# Altium schematic sheet Front_Board.SchDoc
size B; SheetNumber: 2; SheetTotal: 4
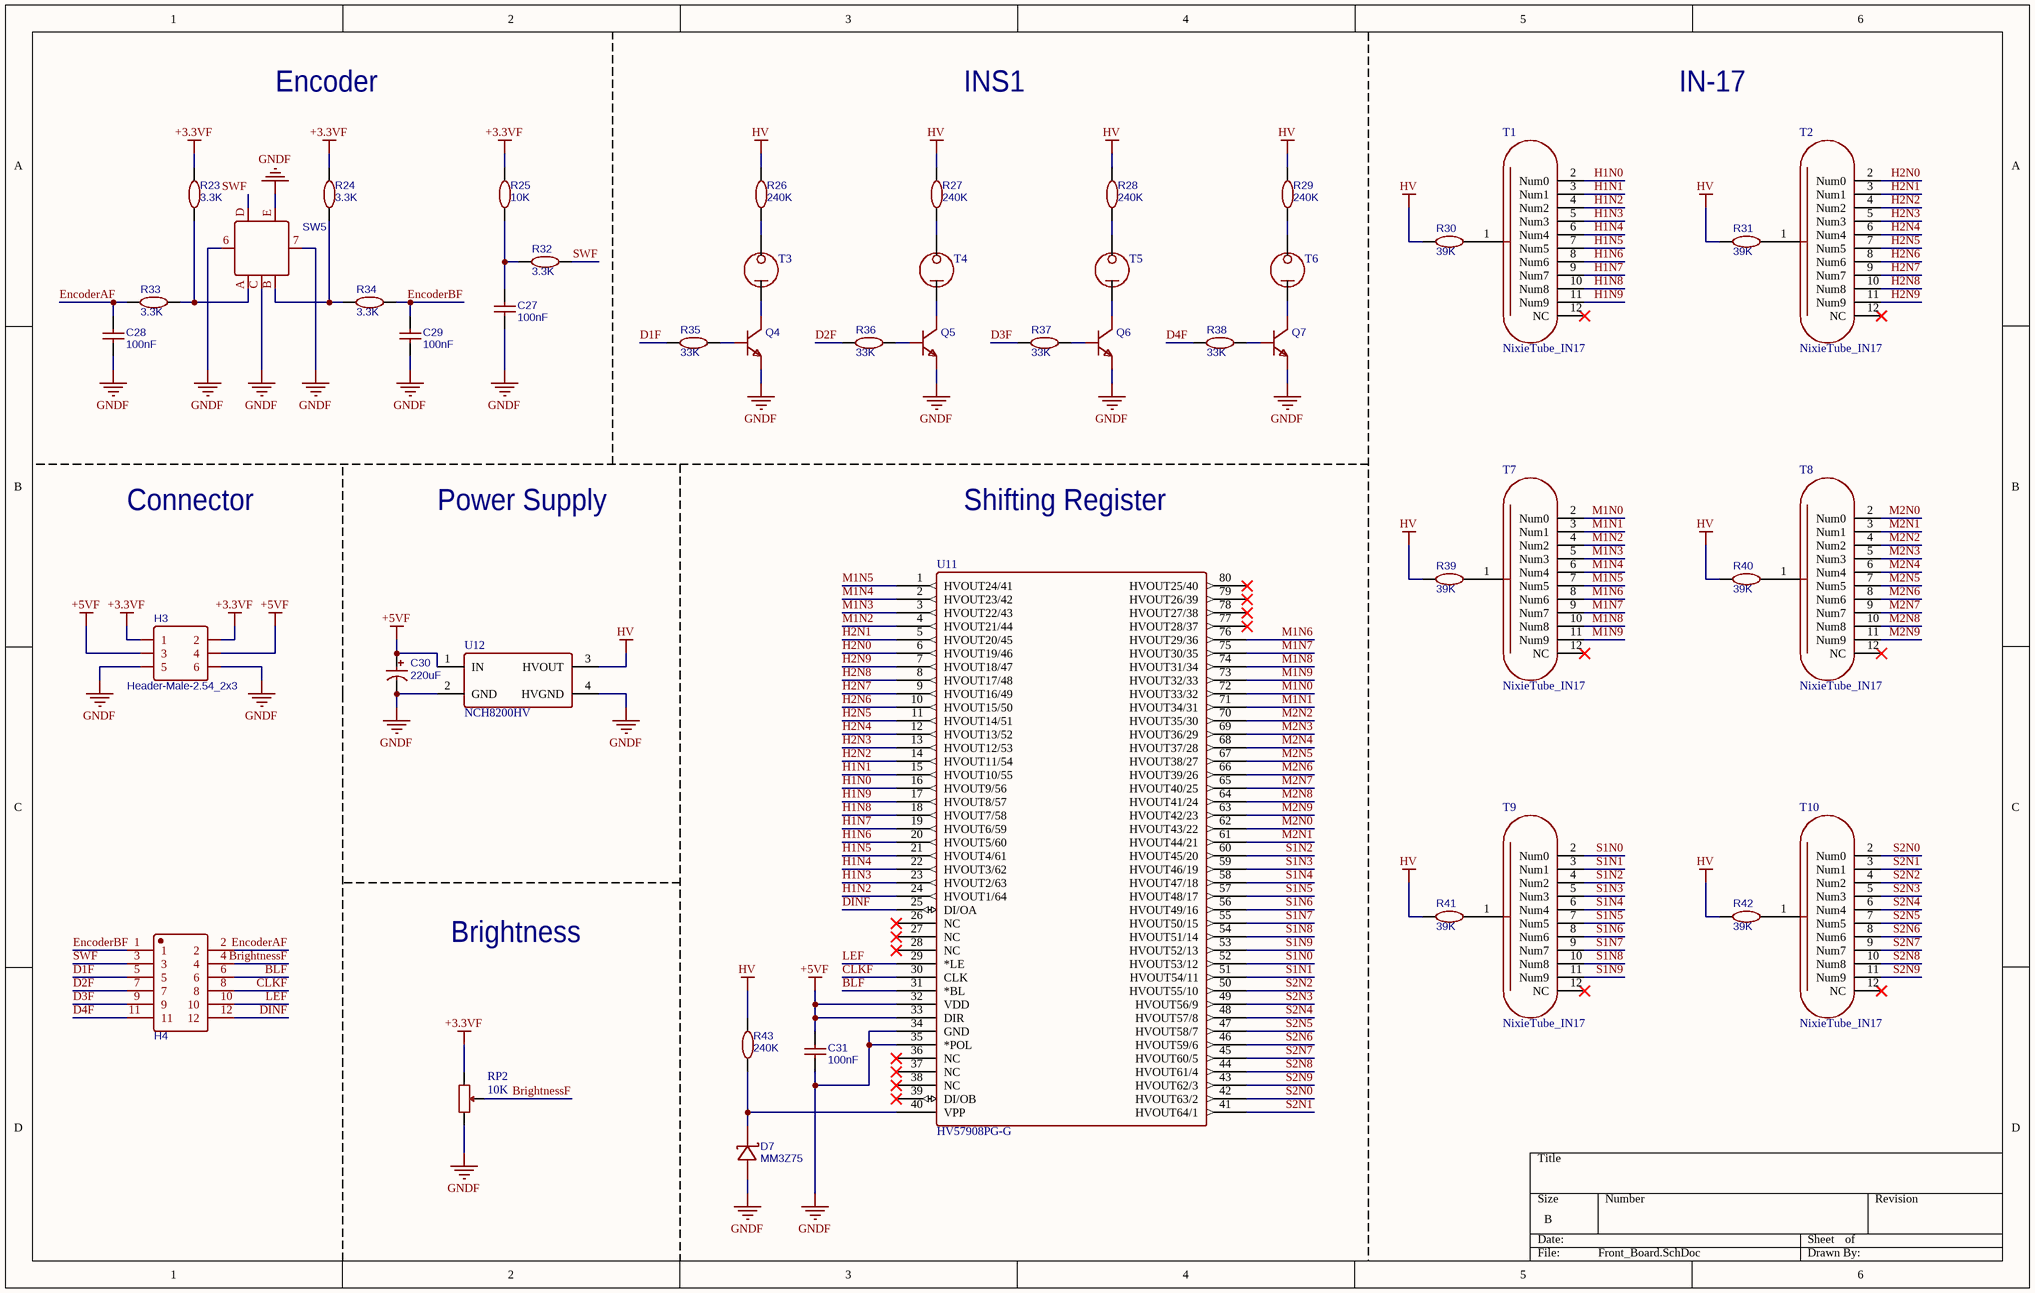
[diagram p0: Front_Board.SchDoc]

## Parts
C27  100nF  [C0402_NEW]
C28  100nF  [C0402_NEW]
C29  100nF  [C0402_NEW]
C30  220uF  [CAP-TH_BD6.3-P2.50-D1.0-FD]
C31  100nF  [C0402_NEW]
D7  MM3Z75  [SOD-323_L1.8-W1.3-LS2.5-RD]
H3  Header-Male-2.54_2x3  [HDR-TH_6P-P2.54-V-M-R2-C3-S2.54-1]
H4  210S-2*6P L=11.6MMGold-plated black  [HDR-TH_12P-P2.54-V-M-R2-C6-S2.54]  (value not drawn)
Q4  MMBTA44_C699224  [SOT-23-3_L2.9-W1.3-P1.90-LS2.4-BR]  (value not drawn)
Q5  MMBTA44_C699224  [SOT-23-3_L2.9-W1.3-P1.90-LS2.4-BR]  (value not drawn)
Q6  MMBTA44_C699224  [SOT-23-3_L2.9-W1.3-P1.90-LS2.4-BR]  (value not drawn)
Q7  MMBTA44_C699224  [SOT-23-3_L2.9-W1.3-P1.90-LS2.4-BR]  (value not drawn)
R23  3.3K  [R0402]
R24  3.3K  [R0402]
R25  10K  [R0402]
R26  240K  [R0805]
R27  240K  [R0805]
R28  240K  [R0805]
R29  240K  [R0805]
R30  39K  [R0805]
R31  39K  [R0805]
R32  3.3K  [R0402]
R33  3.3K  [R0402]
R34  3.3K  [R0402]
R35  33K  [R0402]
R36  33K  [R0402]
R37  33K  [R0402]
R38  33K  [R0402]
R39  39K  [R0805]
R40  39K  [R0805]
R41  39K  [R0805]
R42  39K  [R0805]
R43  240K  [R0805]
RP2  10K  [WH148-W-B10K]
SW5  EC11E09244C3  [SW-TH_EC11E09244C3]  (value not drawn)
T1  NixieTube_IN17  [IN17]
T2  NixieTube_IN17  [IN17]
T3  NixieTube_INS1  [INS-1]  (value not drawn)
T4  NixieTube_INS1  [INS-1]  (value not drawn)
T5  NixieTube_INS1  [INS-1]  (value not drawn)
T6  NixieTube_INS1  [INS-1]  (value not drawn)
T7  NixieTube_IN17  [IN17]
T8  NixieTube_IN17  [IN17]
T9  NixieTube_IN17  [IN17]
T10  NixieTube_IN17  [IN17]
U11  HV57908PG-G  [PQFP80_20X14MC_MCH]
U12  NCH8200HV  [NCH8200HV]

## Nets
+3.3VF: H3.1 H3.2 R23.2 R24.2 R25.2 RP2.1
+5VF: C30.1 C31.2 H3.3 H3.4 U11.32(VDD) U11.33(DIR) U12.1(IN)
GNDF: C27.1 C28.1 C29.1 C30.2 C31.1 D7.2(A) H3.5 H3.6 Q4.2(E) Q5.2(E) Q6.2(E) Q7.2(E) RP2.3 SW5.6(EH) SW5.7(EH) SW5.C SW5.E U11.34(GND) U11.35(*POL) U12.2(GND) U12.4(HVGND)
HV: R26.2 R27.2 R28.2 R29.2 R30.1 R31.1 R39.1 R40.1 R41.1 R42.1 R43.2 U12.3(HVOUT)
BLF: H4.6 U11.31(*BL)
BrightnessF: H4.4 RP2.2
CLKF: H4.8 U11.30(CLK)
D1F: H4.5 R35.1
D2F: H4.7 R36.1
D3F: H4.9 R37.1
D4F: H4.11 R38.1
DINF: H4.12 U11.25(DI/OA)
EncoderAF: C28.2 H4.2 R33.2
EncoderBF: C29.2 H4.1 R34.1
H1N0: T1.2(Num0) U11.16(HVOUT9/56)
H1N1: T1.3(Num1) U11.15(HVOUT10/55)
H1N2: T1.4(Num2) U11.24(HVOUT1/64)
H1N3: T1.5(Num3) U11.23(HVOUT2/63)
H1N4: T1.6(Num4) U11.22(HVOUT3/62)
H1N5: T1.7(Num5) U11.21(HVOUT4/61)
H1N6: T1.8(Num6) U11.20(HVOUT5/60)
H1N7: T1.9(Num7) U11.19(HVOUT6/59)
H1N8: T1.10(Num8) U11.18(HVOUT7/58)
H1N9: T1.11(Num9) U11.17(HVOUT8/57)
H2N0: T2.2(Num0) U11.6(HVOUT19/46)
H2N1: T2.3(Num1) U11.5(HVOUT20/45)
H2N2: T2.4(Num2) U11.14(HVOUT11/54)
H2N3: T2.5(Num3) U11.13(HVOUT12/53)
H2N4: T2.6(Num4) U11.12(HVOUT13/52)
H2N5: T2.7(Num5) U11.11(HVOUT14/51)
H2N6: T2.8(Num6) U11.10(HVOUT15/50)
H2N7: T2.9(Num7) U11.9(HVOUT16/49)
H2N8: T2.10(Num8) U11.8(HVOUT17/48)
H2N9: T2.11(Num9) U11.7(HVOUT18/47)
LEF: H4.10 U11.29(*LE)
M1N0: T7.2(Num0) U11.72(HVOUT33/32)
M1N1: T7.3(Num1) U11.71(HVOUT34/31)
M1N2: T7.4(Num2) U11.4(HVOUT21/44)
M1N3: T7.5(Num3) U11.3(HVOUT22/43)
M1N4: T7.6(Num4) U11.2(HVOUT23/42)
M1N5: T7.7(Num5) U11.1(HVOUT24/41)
M1N6: T7.8(Num6) U11.76(HVOUT29/36)
M1N7: T7.9(Num7) U11.75(HVOUT30/35)
M1N8: T7.10(Num8) U11.74(HVOUT31/34)
M1N9: T7.11(Num9) U11.73(HVOUT32/33)
M2N0: T8.2(Num0) U11.62(HVOUT43/22)
M2N1: T8.3(Num1) U11.61(HVOUT44/21)
M2N2: T8.4(Num2) U11.70(HVOUT35/30)
M2N3: T8.5(Num3) U11.69(HVOUT36/29)
M2N4: T8.6(Num4) U11.68(HVOUT37/28)
M2N5: T8.7(Num5) U11.67(HVOUT38/27)
M2N6: T8.8(Num6) U11.66(HVOUT39/26)
M2N7: T8.9(Num7) U11.65(HVOUT40/25)
M2N8: T8.10(Num8) U11.64(HVOUT41/24)
M2N9: T8.11(Num9) U11.63(HVOUT42/23)
S1N0: T9.2(Num0) U11.52(HVOUT53/12)
S1N1: T9.3(Num1) U11.51(HVOUT54/11)
S1N2: T9.4(Num2) U11.60(HVOUT45/20)
S1N3: T9.5(Num3) U11.59(HVOUT46/19)
S1N4: T9.6(Num4) U11.58(HVOUT47/18)
S1N5: T9.7(Num5) U11.57(HVOUT48/17)
S1N6: T9.8(Num6) U11.56(HVOUT49/16)
S1N7: T9.9(Num7) U11.55(HVOUT50/15)
S1N8: T9.10(Num8) U11.54(HVOUT51/14)
S1N9: T9.11(Num9) U11.53(HVOUT52/13)
S2N0: T10.2(Num0) U11.42(HVOUT63/2)
S2N1: T10.3(Num1) U11.41(HVOUT64/1)
S2N2: T10.4(Num2) U11.50(HVOUT55/10)
S2N3: T10.5(Num3) U11.49(HVOUT56/9)
S2N4: T10.6(Num4) U11.48(HVOUT57/8)
S2N5: T10.7(Num5) U11.47(HVOUT58/7)
S2N6: T10.8(Num6) U11.46(HVOUT59/6)
S2N7: T10.9(Num7) U11.45(HVOUT60/5)
S2N8: T10.10(Num8) U11.44(HVOUT61/4)
S2N9: T10.11(Num9) U11.43(HVOUT62/3)
SWF: H4.3 R32.2 SW5.D
NetC27_2: C27.2 R25.1 R32.1
NetD7_1: D7.1(C) R43.1 U11.40(VPP)
NetQ4_1: Q4.1(B) R35.2
NetQ4_3: Q4.3(C) T3.2(Cathode)
NetQ5_1: Q5.1(B) R36.2
NetQ5_3: Q5.3(C) T4.2(Cathode)
NetQ6_1: Q6.1(B) R37.2
NetQ6_3: Q6.3(C) T5.2(Cathode)
NetQ7_1: Q7.1(B) R38.2
NetQ7_3: Q7.3(C) T6.2(Cathode)
NetR23_1: R23.1 R33.1 SW5.A
NetR24_1: R24.1 R34.2 SW5.B
NetR26_1: R26.1 T3.1(Anode)
NetR27_1: R27.1 T4.1(Anode)
NetR28_1: R28.1 T5.1(Anode)
NetR29_1: R29.1 T6.1(Anode)
NetR30_2: R30.2 T1.1(Anode)
NetR31_2: R31.2 T2.1(Anode)
NetR39_2: R39.2 T7.1(Anode)
NetR40_2: R40.2 T8.1(Anode)
NetR41_2: R41.2 T9.1(Anode)
NetR42_2: R42.2 T10.1(Anode)

Not connected (* = marked no-connect by the designer): T1 12(NC)*; T2 12(NC)*; T7 12(NC)*; T8 12(NC)*; T9 12(NC)*; T10 12(NC)*; U11 26(NC)* 27(NC)* 28(NC)* 36(NC)* 37(NC)* 38(NC)* 39(DI/OB)* 77(HVOUT28/37)* 78(HVOUT27/38)* 79(HVOUT26/39)* 80(HVOUT25/40)*

## Notes on the sheet
- Encoder
- INS1
- IN-17
- Connector
- Power Supply
- Shifting Register
- Brightness

## Library data of the parts
C27-C29 C31 = 100nF: BOM_Manufacturer Part: CL05B104KO5NNNC; BOM_Manufacturer: SAMSUNG(三星); nameAlias: Capacitance; BOM_Supplier: LCSC; BOM_Supplier Part: C1525; BOM_JLCPCB Part Class: Basic Part; spicePre: C; spiceSymbolName: CL05B104KO5NNNC
C30 = 220uF: BOM_Manufacturer: CX(承兴); BOM_Manufacturer Part: EF227M010E05RR0VH4FP0; nameAlias: Capacitance; BOM_Supplier: LCSC; BOM_Supplier Part: C43330; BOM_JLCPCB Part Class: Extended Part; spicePre: C; spiceSymbolName: 220uF 10Vblack gold 6.3*5
D7 = MM3Z75: BOM_Manufacturer: ST(先科); Contributor: LCSC; BOM_Supplier: LCSC; BOM_Manufacturer Part: MM3Z75; BOM_Supplier Part: C118626; BOM_JLCPCB Part Class: Extended Part; spicePre: D; spiceSymbolName: MM3Z75
H3 = Header-Male-2.54_2x3: BOM_Manufacturer: BOOMELE(博穆精密); BOM_Manufacturer Part: 2.54-2*3P针; BOM_Supplier: LCSC; BOM_Supplier Part: C65114; BOM_JLCPCB Part Class: Extended Part; spicePre: J; spiceSymbolName: Header-Male-2.54_2x3
H4 = Header-Male-2.54_2x6: BOM_Manufacturer: Ckmtw(灿科盟); BOM_Manufacturer Part: B-2100S12P-B110; Contributor: LCSC; BOM_Supplier: LCSC; BOM_Supplier Part: C124388; BOM_JLCPCB Part Class: Extended Part; spicePre: H; spiceSymbolName: 210S-2*6P L=11.6MMGold-plated black
Q4-Q7 = MMBTA44_C699224: BOM_Manufacturer: YANGJIE(扬杰); Contributor: LCSC; BOM_Supplier: LCSC; BOM_Supplier Part: C699224; BOM_Manufacturer Part: MMBTA44; BOM_JLCPCB Part Class: Extended Part; spicePre: Q; spiceSymbolName: MMBTA44_C699224
R23 R24 R32-R34 = 3.3K: BOM_Manufacturer: YAGEO(国巨); BOM_Manufacturer Part: RC0402FR-073K3L; nameAlias: Resistance (Ohms); Resistance: 3.3kΩ; BOM_Supplier: LCSC; BOM_Supplier Part: C137992; BOM_JLCPCB Part Class: Extended Part; spicePre: R; spiceSymbolName: RC0402FR-073K3L
R25 = 10K: BOM_Manufacturer: YAGEO(国巨); BOM_Manufacturer Part: RC0402FR-0710KL; nameAlias: Resistance (Ohms); Resistance: 10kΩ; BOM_Supplier: LCSC; BOM_Supplier Part: C60490; BOM_JLCPCB Part Class: Extended Part; spicePre: R; spiceSymbolName: RC0402FR-0710KL
R26-R29 R43 = 240K: BOM_Manufacturer: YAGEO(国巨); BOM_Manufacturer Part: RC0805FR-07240KL; nameAlias: Resistance (Ohms); Resistance: 240kΩ; BOM_Supplier: LCSC; BOM_Supplier Part: C137564; BOM_JLCPCB Part Class: Extended Part; spicePre: R; spiceSymbolName: RC0805FR-07240KL
R30 R31 R39-R42 = 39K: BOM_Manufacturer: YAGEO(国巨); BOM_Manufacturer Part: RC0805FR-0720KL; nameAlias: Resistance (Ohms); Resistance: 20kΩ; BOM_Supplier: LCSC; BOM_Supplier Part: C114566; BOM_JLCPCB Part Class: Extended Part; spicePre: R; spiceSymbolName: RC0805FR-0720KL
R35-R38 = 33K: BOM_Manufacturer: YAGEO(国巨); BOM_Manufacturer Part: RC0402FR-0733KL; nameAlias: Resistance (Ohms); Resistance: 33kΩ; BOM_Supplier: LCSC; BOM_Supplier Part: C138003; BOM_JLCPCB Part Class: Extended Part; spicePre: R; spiceSymbolName: RC0402FR-0733KL
RP2 = RP-WH148: BOM名称: 插件电位器; 版权归属: 源创客; 学习资源: www.ooocke.com
SW5 = EC11E09244C3: BOM_Manufacturer: ALPSALPINE(阿尔卑斯阿尔派); Contributor: LCSC; BOM_Supplier: LCSC; BOM_Supplier Part: C2687283; BOM_Manufacturer Part: EC11E09244C3; BOM_JLCPCB Part Class: Extended Part; spicePre: S; spiceSymbolName: EC11E09244C3
U11 = HV57908PG-G: Mfr_Name: Microchip; Copyright: Copyright (C) 2022 Ultra Librarian. All rights reserved.; Manufacturer_Part_Number: HV57908PG-G; RefDes: RefDes; Type: DEV